# EAGLE board apa102-controller (EAGLE 7.1.0)
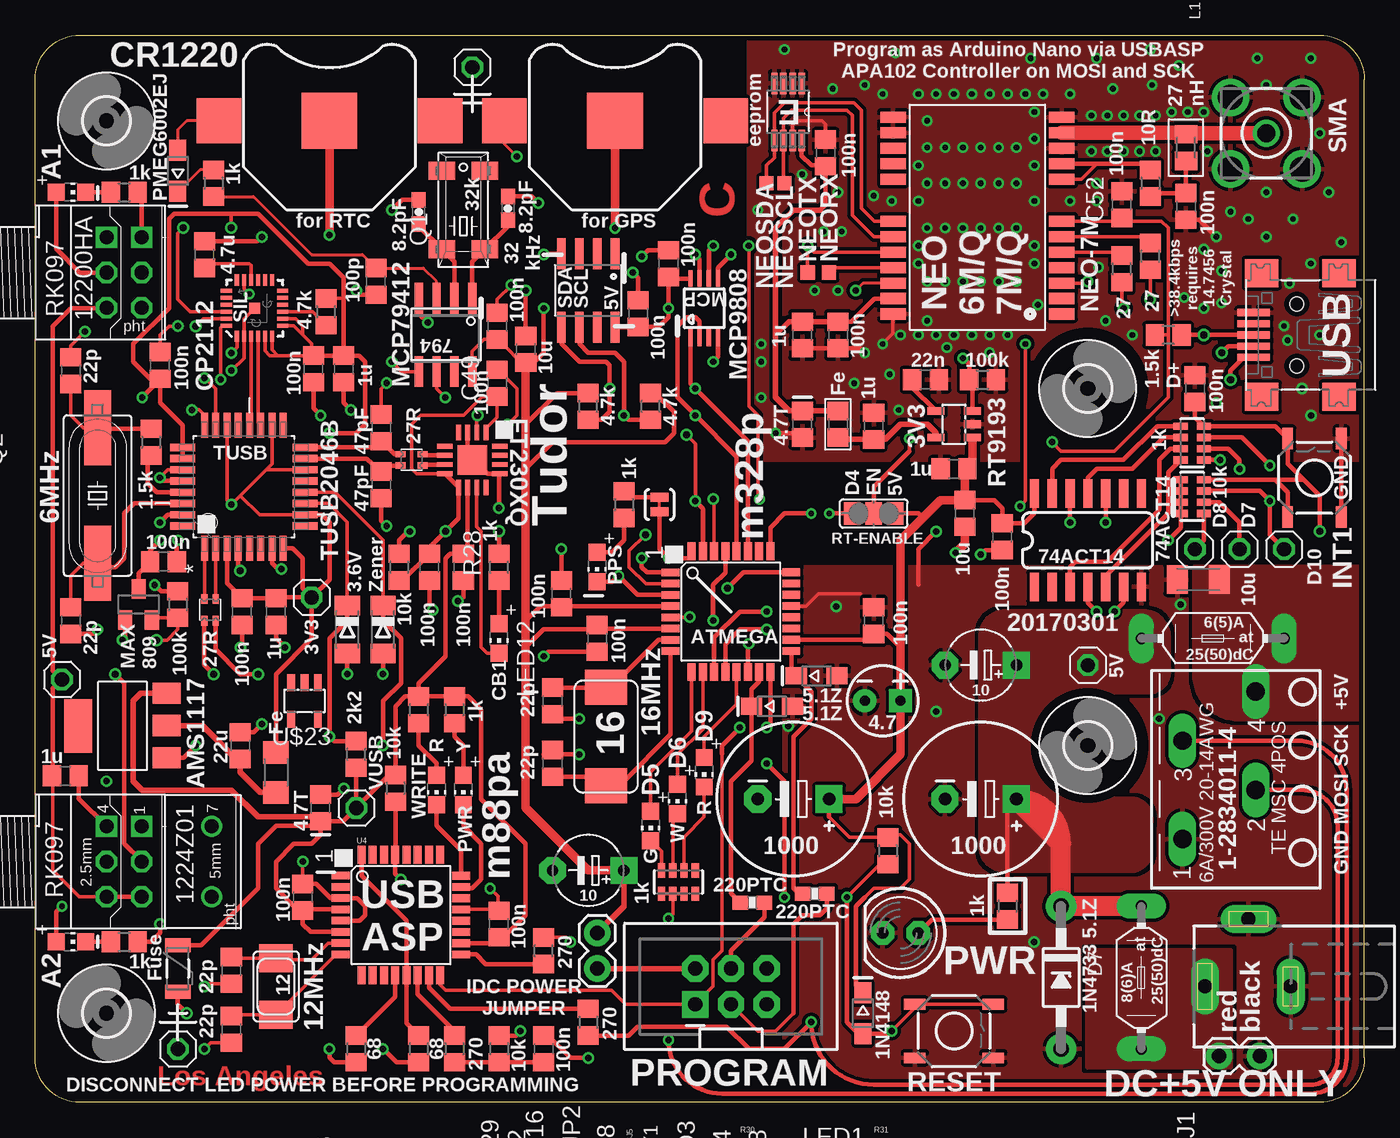
[diagram p2: board, top side]
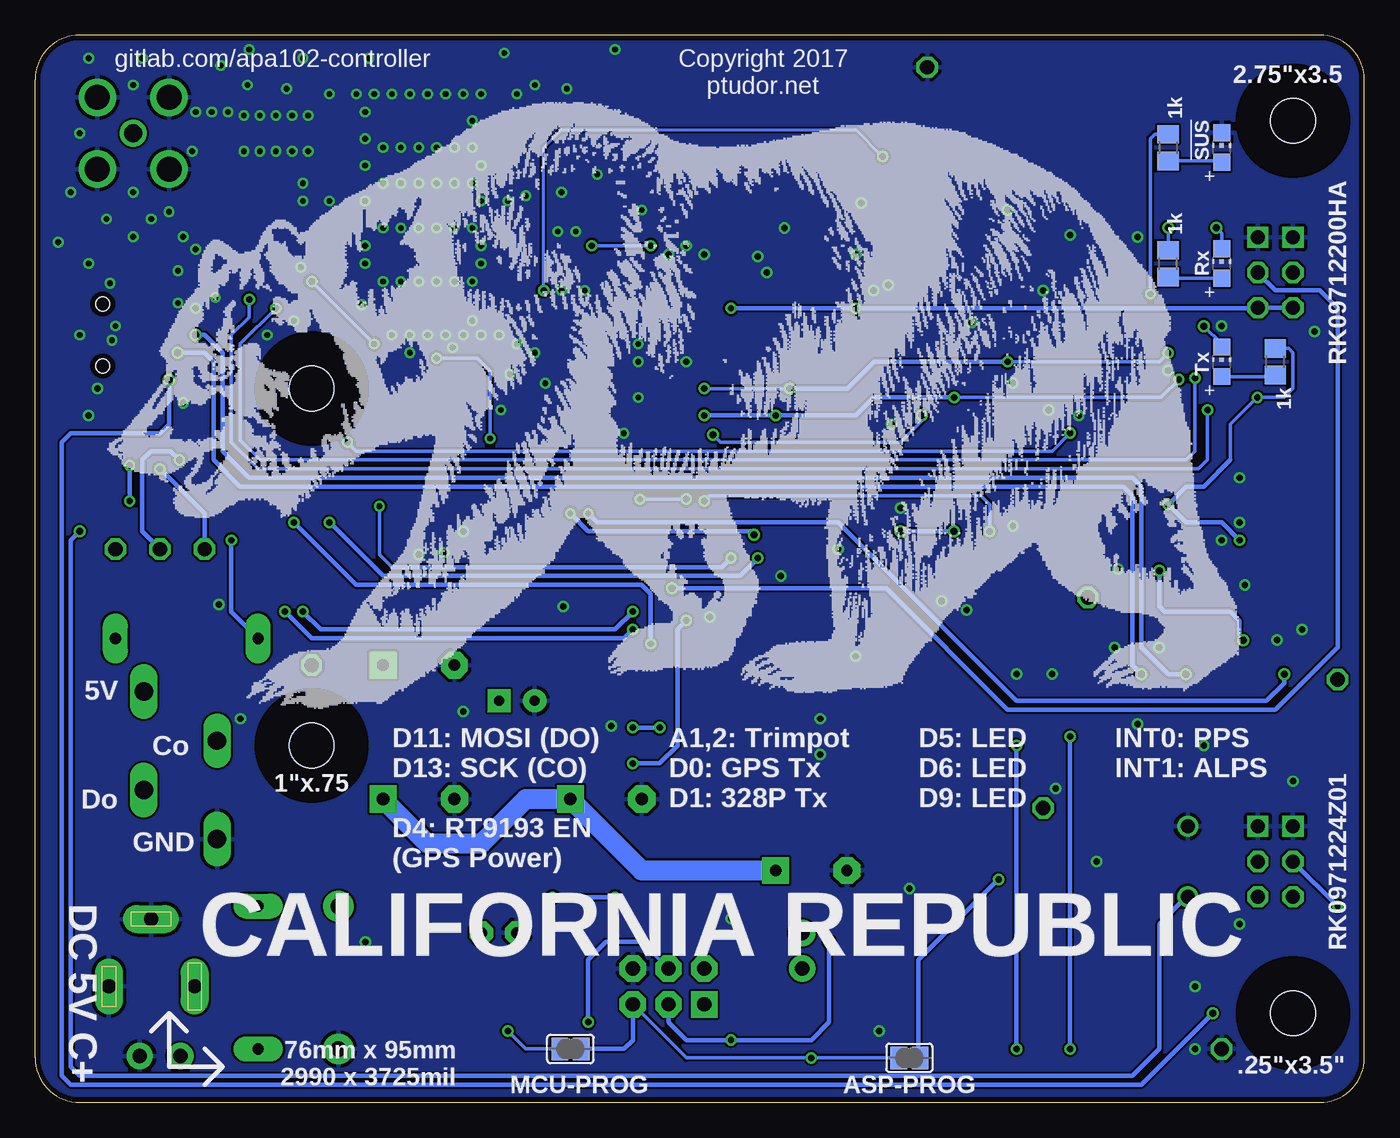
[diagram p3: board, bottom side, seen from below]

Size 94.61 x 75.95 mm. Coordinates in mm from the lower left corner, seen from the top.
Outline: 3.17,75.95 91.44,75.95 arc-90 94.61,72.77 94.61,3.17 arc-90 91.44,0 3.17,0 arc-90 0,3.17 0,72.77 arc-90 3.17,75.95
Copper layers (1*16): Top 0.0356mm / dielectric 1.5011mm / Bottom 0.0356mm
Design rules "LaenPCBOrder *": minimum track width 6mil, minimum drill 13mil, track to track 6mil, track to pad 6mil, pad to pad 6mil, via to via 6mil, smd to smd 6mil, copper to edge 15mil, drill to drill 6mil, minimum pad ring 7mil, minimum via ring 7mil, stop-mask expansion 3mil, vias tented up to drill 25mil, thermal gap 10mil
Net classes: 0 default: width 0.254 mm

## Footprints (pad centres in the part's own frame; a part is rotated, then mirrored left to right if it is on the bottom)
TP10SQ = smd 1 x 1: TP 0,0
BATTCON_12MM = smd 3.962 x 3.962: GND 0,0 | smd 3.175 x 3.175: PWR@1 -7.874,0; PWR@2 7.874,0
C0805 = smd 1.3 x 1.5: 1 -0.95,0; 2 0.95,0
E5-5 = drill 0.813 pad 1.905 square: + -2.54,0 | drill 0.813 pad 1.905 octagon: - 2.54,0
0603-CAP = smd 1.1 x 1: 1 -0.85,0; 2 0.85,0
CPOL-RADIAL-1000UF-25V = drill 0.9 pad 1.93 square: + 2.54,0 | drill 0.9 pad 1.93 octagon: - -2.54,0
CPOL-RADIAL-10UF-25V-KIT = drill 0.7 pad 1.651 square: 1 1.27,0 | drill 0.7 pad 1.651: 2 -1.27,0
C1206K = smd 1.5 x 2: 1 -1.5,0; 2 1.5,0
USB-MINIB = smd 0.5 x 2.308: D+ 0,4.064; D- -0.8,4.064; GND 1.6,4.064; ID 0.8,4.064; VBUS -1.6,4.064 | smd 2 x 2.4: GND1 -4.4,-2; GND2 -4.4,3.5; GND3 4.4,3.5; GND4 4.4,-2 | hole 1: -2.2,1; 2.2,1
MINIMELF@1 = smd 1.4 x 1.8: A 1.7,0; C -1.7,0
SOD323-W@1 = smd 1.5 x 1.2: A 1.45,0; C -1.45,0
DO41Z10 = drill 1.118 pad 2.184: A 5.08,0; C -5.08,0
LITTLEFUSE = drill 0.813 pad 1.778 long: 1 -5.08,0; 2 5.08,0
PTC-1206-WIDE = smd 1 x 1.8: 1 -1.654,0; 2 1.654,0
0805 = smd 1.3 x 1.5: 1 -0.95,0; 2 0.95,0
3,2 = hole 3.2: 0,0
SOT223 = smd 1.499 x 2.007: 1 -2.261,-3.15; 2 0.025,-3.15; 3 2.311,-3.15 | smd 3.81 x 2.007: 4 0,3.15
SOT23B-3 = smd 1 x 1.4: 1 -0.95,-1.1; 2 0.95,-1.1; 3 0,1.1
SOIC-8 = smd 0.6 x 2.2: 1 -1.905,-2.6; 2 -0.635,-2.6; 3 0.635,-2.6; 4 1.905,-2.6; 5 1.905,2.6; 6 0.635,2.6; 7 -0.635,2.6; 8 -1.905,2.6
CHIP-LED0805 = smd 1.2 x 1.2: A 0,-1.05; C 0,1.05
DCJ0202 = drill 1 pad 2 long: 1 0,3.1; 2 4.8,0; 3 0,-3
2X3-SHROUDED = drill 1.016 pad 1.88 square: 1 -1.27,2.54 | drill 1.016 pad 1.88 octagon: 2 1.27,2.54; 3 -1.27,0; 4 1.27,0; 5 -1.27,-2.54; 6 1.27,-2.54
1X02 = drill 1.016 pad 1.88: 1 0,0; 2 2.54,0
1X02_LOCK = drill 1.016 pad 1.88: 1 -0.178,0; 2 2.718,0
M0805 = smd 1.3 x 1.6: 1 -0.95,0; 2 0.95,0
FB1206 = smd 1.6 x 1.803: 1 -1.422,0; 2 1.422,0
LED5MM = drill 0.813 pad 1.676 octagon: A -1.27,0; K 1.27,0
MM20SS = smd 1.27 x 1.88: 1 -2.794,-1.524; 2 2.794,-1.524; 3 2.794,1.524; 4 -2.794,1.524
HC49UP = smd 5.334 x 1.93: 1 -4.826,0; 2 4.826,0
R0805 = smd 1.3 x 1.5: 1 -0.95,0; 2 0.95,0
0603-RES = smd 1.1 x 1: 1 -0.85,0; 2 0.85,0
EXBV4V = smd 0.45 x 0.7: 1 -0.4,-0.775; 2 0.4,-0.775; 3 0.4,0.775; 4 -0.4,0.775
RES4NT = smd 0.508 x 1.016: 1 0,0; 2 0.8,0; 3 1.6,0; 4 2.4,0; 5 2.4,1.651; 6 1.6,1.651; 7 0.8,1.651; 8 0,1.651
TACTILE-SWITCH-SMD = smd 1.524 x 0.762: 1 -2.794,1.905; 2 2.794,1.905; 3 -2.794,-1.905; 4 2.794,-1.905
SJ = smd 1.168 x 1.6: 1 -0.762,0; 2 0.762,0
SJ_2 = smd 1.168 x 1.6: 1 -1.524,0; 2 0,0; 3 1.524,0
SJ_2S-TRACE = smd 0.635 x 1.27: 1 -0.508,0; 2 0.508,0
TQFP32-08 = smd 1.27 x 0.533: 1 -4.293,2.8; 2 -4.293,2; 3 -4.293,1.2; 4 -4.293,0.4; 5 -4.293,-0.4; 6 -4.293,-1.2; 7 -4.293,-2; 8 -4.293,-2.8 | smd 0.559 x 1.27: 9 -2.8,-4.293; 10 -2,-4.293; 11 -1.2,-4.293; 12 -0.4,-4.293; 13 0.4,-4.293; 14 1.2,-4.293; 15 2,-4.293; 16 2.8,-4.293; 25 2.8,4.293; 26 2,4.293; 27 1.2,4.293; 28 0.4,4.293; 29 -0.4,4.293; 30 -1.2,4.293; 31 -2,4.293; 32 -2.8,4.293 | smd 1.27 x 0.559: 17 4.293,-2.8; 18 4.293,-2; 19 4.293,-1.2; 20 4.293,-0.4; 21 4.293,0.4; 22 4.293,1.2; 23 4.293,2; 24 4.293,2.8
SOIC-14 = smd 0.66 x 2.032: 1 -4.445,-3.315; 2 -3.175,-3.315; 3 -1.905,-3.315; 4 -0.635,-3.315; 5 0.635,-3.315; 6 1.905,-3.315; 7 3.175,-3.315; 8 3.175,3.315; 9 1.905,3.315; 10 0.635,3.315; 11 -0.635,3.315; 12 -1.905,3.315; 13 -3.175,3.315; 14 -4.445,3.315
SOP65P490X110-8N = smd 1.524 x 0.457: 1 -2.032,0.965; 2 -2.032,0.33; 3 -2.032,-0.33; 4 -2.032,-0.965; 5 2.032,-0.965; 6 2.032,-0.33; 7 2.032,0.33; 8 2.032,0.965
TEXAS-INSTRUMENTS_BY_ELEMENT14_BATCH_1_QFP80P900X900X145-32N = smd 1.778 x 0.508: 1 -4.369,2.794; 2 -4.369,2.007; 3 -4.369,1.194; 4 -4.369,0.406; 5 -4.369,-0.406; 6 -4.369,-1.194; 7 -4.369,-2.007; 8 -4.369,-2.794; 17 4.369,-2.794; 18 4.369,-2.007; 19 4.369,-1.194; 20 4.369,-0.406; 21 4.369,0.406; 22 4.369,1.194; 23 4.369,2.007; 24 4.369,2.794 | smd 0.508 x 1.778: 9 -2.794,-4.369; 10 -2.007,-4.369; 11 -1.194,-4.369; 12 -0.406,-4.369; 13 0.406,-4.369; 14 1.194,-4.369; 15 2.007,-4.369; 16 2.794,-4.369; 25 2.794,4.369; 26 2.007,4.369; 27 1.194,4.369; 28 0.406,4.369; 29 -0.406,4.369; 30 -1.194,4.369; 31 -2.007,4.369; 32 -2.794,4.369
SOT23-5 = smd 0.55 x 1.2: 1 -0.95,-1.3; 2 0,-1.3; 3 0.95,-1.3; 4 0.95,1.3; 5 -0.95,1.3
UBLOX_NEO-6P = smd 1.8 x 0.8: 1_RESERVED 6.4,-7.4; 2_SS_N 6.4,-6.3; 3_TIMEPULSE 6.4,-5.2; 4_EXTINT0 6.4,-4.1; 5_USB_DM 6.4,-3; 6_USB_DP 6.4,-1.9; 7_VDDUSB 6.4,-0.8; 8_RESERVED 6.4,2.2; 9_VCC_RF 6.4,3.3; 10_GND 6.4,4.4; 11_RF_IN 6.4,5.5; 12_GND 6.4,6.6; 13_GND -5.6,6.6; 14_MOSI/CFG_COM0 -5.6,5.5; 15_MISO/CFG_COM1 -5.6,4.4; 16_CFG_CPS0/SCK -5.6,3.3; 17_RESERVED -5.6,2.2; 18_SDA2 -5.6,-0.8; 19_SCL2 -5.6,-1.9; 20_TXD1 -5.6,-3; 21_RXD1 -5.6,-4.1; 22_V_BCKP -5.6,-5.2; 23_VCC -5.6,-6.3; 24_GND -5.6,-7.4
BUS-SMA = drill 1.27: 1 0,0 | drill 1.778: 2 -2.55,2.55; 3 2.55,2.55; 4 2.55,-2.55; 5 -2.55,-2.55
MSOP08 = smd 0.3 x 1.2: 1 -0.976,-2.113; 2 -0.326,-2.113; 3 0.324,-2.113; 4 0.974,-2.113; 5 0.974,2.112; 6 0.324,2.112; 7 -0.326,2.112; 8 -0.976,2.112
QFN-24 = smd 0.8 x 0.3: 1 -2,1.25; 2 -2,0.75; 3 -2,0.25; 4 -2,-0.25; 5 -2,-0.75; 6 -2,-1.25; 13 2,-1.25; 14 2,-0.75; 15 2,-0.25; 16 2,0.25; 17 2,0.75; 18 2,1.25 | smd 0.3 x 0.8: 7 -1.25,-2; 8 -0.75,-2; 9 -0.25,-2; 10 0.25,-2; 11 0.75,-2; 12 1.25,-2; 19 1.25,2; 20 0.75,2; 21 0.25,2; 22 -0.25,2; 23 -0.75,2; 24 -1.25,2 | smd 0.762 x 0.762: PAD 0,0
TE-MSC-4POS-6A = drill 1.3 long: P$1 -4.5,3.8; P$2 -1,-1.4; P$3 2.5,3.8; P$4 6,-1.4
SO08 = smd 0.61 x 2.21: 1 -1.905,-2.616; 2 -0.635,-2.616; 3 0.635,-2.616; 4 1.905,-2.616; 5 1.905,2.616; 6 0.635,2.616; 7 -0.635,2.616; 8 -1.905,2.616
RK097-DUAL-ELEMENT = drill 1 pad 1.422 square: P$1 -2.5,0; P$4 -2.5,2.5 | drill 1 pad 1.422 octagon: P$2 0,0; P$3 2.5,0; P$5 0,2.5; P$6 2.5,2.5
RK097-DUAL-ELEMENT-W/SWITCH = drill 1 pad 1.422 square: P$1 -2.5,2.5; P$4 -2.5,0 | drill 1 pad 1.422 octagon: P$2 0,2.5; P$3 2.5,2.5; P$5 0,0; P$6 2.5,0 | drill 1 pad 1.422: P$7 -2.5,7.5; P$8 2.5,7.5
QFN4X4-16 = smd 1.1 x 0.35: 1 -1.95,0.975; 2 -1.95,0.325; 3 -1.95,-0.325; 4 -1.95,-0.975; 9 1.95,-0.975; 10 1.95,-0.325; 11 1.95,0.325; 12 1.95,0.975 | smd 0.35 x 1.1: 5 -0.975,-1.95; 6 -0.325,-1.95; 7 0.325,-1.95; 8 0.975,-1.95; 13 0.975,1.95; 14 0.325,1.95; 15 -0.325,1.95; 16 -0.975,1.95 | smd 2.1 x 2.1: C 0,0
SOT23-5L = smd 0.55 x 1.2: 1 -0.95,-1.3; 2 0,-1.3; 3 0.95,-1.3; 4 0.95,1.3; 5 -0.95,1.3
WPAD-1-PTH-2.54 = drill 1.016 octagon: 1 0,0
NX5032 = smd 2 x 2.4: P$1 2,0; P$2 -2,0
CRYSTAL-ABRACON-ABM2 = smd 2.5 x 3: P$1 -3.5,0; P$2 3.5,0

## Placement (x,y rotation side)
18  TPTP10SQ  [TP10SQ]  52.07,65.41 90 top
19  TPTP10SQ  [TP10SQ]  53.34,65.41 90 top
BAT1  [BATTCON_12MM]  41.27,69.85 0 top
BAT2  [BATTCON_12MM]  20.95,69.85 0 top
C1  1u  [C0805]  54.61,48.26 270 top
C2  100n  [C0805]  57.15,54.61 270 top
C3  100pf  [C0805]  24.26,58.42 270 top
C4  [E5-5]  67.31,31.11 180 top
C5  100  [C0805]  37.47,36.2 90 top
C6  [E5-5]  39.37,16.51 180 top
C7  [C0805]  36.83,28.57 270 top
C8  [C0805]  36.83,24.13 90 top
C9  10 uF  [C0805]  66.17,41.91 270 top
C10  4.7uF  [C0805]  12.06,60.33 90 top
C11  [C0805]  59.69,34.29 90 top
C12  [C0805]  68.83,40.26 270 top
C13  10  [C0805]  34.92,53.59 90 top
C14  8.2pF  [0603-CAP]  33.66,63.63 90 top
C15  8.2pF  [0603-CAP]  27.3,63.37 90 top
C16  100  [C0805]  40.01,33.02 270 top
C17  [C0805]  32.89,55.24 90 top
C18  100  [C0805]  54.61,54.61 270 top
C19  22pF  [C0805]  13.97,5.21 270 top
C20  1uF  [C0805]  59.69,48.13 90 top
C21  CAP-09538  [CPOL-RADIAL-1000UF-25V]  67.31,21.59 0 top
C22  CAP-09538  [CPOL-RADIAL-1000UF-25V]  53.98,21.59 0 top
C23  100nF  [C0805]  81.92,63.75 270 top
C24  0.1  [C0805]  56.26,67.56 90 top
C25  100nF  [C0805]  45.09,59.69 90 top
C26  [CPOL-RADIAL-10UF-25V-KIT]  60.33,28.57 0 top
C27  22pF  [C0805]  13.97,9.4 270 top
C28  100  [C0805]  19.05,14.61 90 top
C29  100nF  [C0805]  33.02,12.7 90 top
C30  4.7 tant  [C0805]  20.32,20.95 90 top
C31  1uF  [C0805]  21.97,52.2 270 top
C32  100nF  [C0805]  19.81,52.2 270 top
C33  47pF  [C0805]  24.64,43.94 270 top
C34  47pF  [C0805]  24.64,48.01 90 top
C35  22uF  [C0805]  14.61,25.4 90 top
C36  22pF  [C0805]  2.54,34.29 270 top
C37  22pF  [C0805]  2.54,52.07 90 top
C38  100nF  [C0805]  17.14,34.92 270 top
C39  100nF  [C0805]  14.73,34.92 270 top
C40  1uF  [C0805]  8.89,52.45 90 top
C41  1uF  [C0805]  65.41,45.09 180 top
C42  22nF low noise  [C0805]  63.37,51.44 0 top
C43  100nF  [C0805]  30.48,38.1 270 top
C44  100nF  [C0805]  28.07,38.1 270 top
C45  [C1206K]  82.8,37.21 180 top
C46  100nF  [C0805]  42.93,56.13 90 top
C47  10 uF  [C0805]  82.55,50.8 90 top
C48  100nF  [C0805]  9.14,38.48 0 top
C49  100n  [C0805]  32.89,51.18 90 top
C50  100nF  [C0805]  2.16,23.24 0 top
C51  100nF  [C0805]  36.2,3.81 90 top
C52  100nF  [C0805]  77.34,63.88 90 top
CN1  [USB-MINIB]  90.81,54.61 90 top
D1  [MINIMELF@1]  24.77,33.66 270 top
D2  [MINIMELF@1]  22.23,33.66 270 top
D3  Schottky  [SOD323-W@1]  10.16,66.29 90 top
D4  5.1Z  [SOD323-W@1]  52.45,28.19 0 top
D5  5.1Z  [SOD323-W@1]  55.63,30.35 0 top
D6  1n4148-ish  [SOD323-W@1]  58.93,6.35 270 top
D7  [DO41Z10]  73.03,8.89 270 top
F1  [LITTLEFUSE]  78.74,8.89 90 top
F2  [LITTLEFUSE]  83.82,33.02 0 top
F3  PTCSMD-W  [PTC-1206-WIDE]  10.16,9.53 270 top
FB1  [0805]  57.15,48.26 90 top
H1  MOUNT-HOLE3.2  [3,2]  5.08,6.35 90 top
H2  MOUNT-HOLE3.2  [3,2]  74.93,25.4 0 top
H3  MOUNT-HOLE3.2  [3,2]  74.93,50.8 0 top
H4  MOUNT-HOLE3.2  [3,2]  5.08,69.85 90 top
IC1  REG1117  [SOT223]  6.22,26.8 90 top
IC2  [SOT23B-3]  7.37,35.43 0 top
IC3  IC_MCP7940M-SOIC8  [SOIC-8]  29.21,54.61 180 top
ISUSPEND  A1-WRITE  [CHIP-LED0805]  10.16,67.94 0 bottom
J1  DCJ0202  [DCJ0202]  86.36,8.26 90 top
JP1  [2X3-SHROUDED]  49.53,8.26 90 top
JP2  M02PTH  [1X02]  40.01,9.53 90 top
JP3  M02LOCK  [1X02_LOCK]  84.45,3.3 0 top
L1  27nH  [M0805]  81.92,67.94 270 top
L2  [FB1206]  17.14,23.5 90 top
LED1  PWR-5MM  [LED5MM]  61.59,12.06 180 top
LED2  A0-POWER  [CHIP-LED0805]  30.48,22.23 180 top
LED3  D5  [CHIP-LED0805]  43.81,19.68 180 top
LED4  D6  [CHIP-LED0805]  45.72,21.59 180 top
LED5  A1-WRITE  [CHIP-LED0805]  28.57,22.23 180 top
LED6  G0-TX  [CHIP-LED0805]  10.16,52.7 0 bottom
LED7  G1-RX  [CHIP-LED0805]  10.16,59.69 0 bottom
LED8  D9  [CHIP-LED0805]  47.62,23.5 180 top
LED9  PPS  [CHIP-LED0805]  40.01,38.1 180 top
LED10  [CHIP-LED0805]  2.54,11.43 270 top
LED11  [CHIP-LED0805]  2.54,64.77 270 top
LED12  CBUS1  [CHIP-LED0805]  33.02,33.02 180 top
Q1  [MM20SS]  30.48,63.5 90 top
Q2  [HC49UP]  4.45,43.18 270 top
R1  1k  [R0805]  12.7,65.41 270 top
R2  27-68  [R0805]  79.38,60.2 90 top
R3  [R0805]  43.81,49.53 90 top
R4  [R0805]  39.37,49.53 90 top
R5  27-68  [R0805]  77.34,59.31 90 top
R6  10k  [R0805]  25.65,22.35 270 top
R7  [R0805]  69.22,13.97 270 top
R8  270  [R0805]  29.84,3.81 270 top
R9  10k  [R0805]  60.71,17.91 270 top
R10  [R0805]  6.35,11.43 0 top
R11  10k  [R0805]  25.91,38.1 270 top
R12  10  [R0805]  79.38,65.41 270 top
R13  100k  [R0805]  10.16,35.43 270 top
R14  270  [R0805]  39.37,5.71 270 top
R15  1.5k  [R0805]  8.26,46.99 270 top
R16  270  [R0805]  36.2,10.79 90 top
R17  2k2  [R0805]  22.86,24.77 90 top
R18  68  [R0805]  22.86,3.81 270 top
R19  68  [R0805]  27.3,3.81 270 top
R20  1k  [R0805]  29.84,27.94 270 top
R21  1k  [R0805]  27.3,27.94 270 top
R22  1k  [R0805]  6.35,52.7 90 bottom
R23  1k  [R0805]  13.97,59.69 90 bottom
R24  4.7k  [R0805]  20.7,56.26 270 top
R25  [R0805]  6.35,64.77 0 top
R26  [R0805]  41.91,42.55 270 top
R27  1.5k  [R0805]  80.64,54.61 180 top
R28  1k  [R0805]  33.02,38.1 90 top
R29  1k  [R0805]  13.97,67.94 270 bottom
R30  220PTC  [0603-RES]  51.05,14.22 0 top
R31  220PTC  [0603-RES]  55.5,14.86 0 top
R32  1k  [R0805]  33.02,3.81 270 top
R33  100k  [R0805]  67.44,51.44 0 top
RN1  [EXBV4V]  12.45,35.05 0 top
RN2  [EXBV4V]  26.8,45.72 270 top
RP1  1k  [RES4NT]  46.99,16.51 180 top
RP2  10k  [RES4NT]  83.19,41.91 90 top
RP3  1k  [RES4NT]  83.19,45.72 90 top
S1  [TACTILE-SWITCH-SMD]  65.41,5.08 0 top
S2  [TACTILE-SWITCH-SMD]  91.06,44.45 90 top
SJ2  [SJ]  56.52,3.81 0 bottom
SJ3  [SJ]  32.38,3.17 180 bottom
SJ4  [SJ_2]  59.69,41.91 0 top
SJ5  SOLDERJUMPERTRACE  [SJ_2S-TRACE]  44.45,42.55 90 top
TP1  TPTP10SQ  [TP10SQ]  54.99,59.05 90 top
TP2  TPTP10SQ  [TP10SQ]  56.52,59.05 90 top
U1  ATMEGA328P  [TQFP32-08]  49.53,34.92 0 top
U2  74HC04_HEX_INVERTERSOIC  [SOIC-14]  75.56,40.01 0 top
U3  24AA32A-I/MS  [SOP65P490X110-8N]  53.59,70.48 270 top
U4  ATMEGA328P  [TQFP32-08]  26.04,13.34 0 top
U5  TEXAS-INSTRUMENTS_BY_ELEMENT14_BATCH_1_TUSB2046BVF  [TEXAS-INSTRUMENTS_BY_ELEMENT14_BATCH_1_QFP80P900X900X145-32N]  14.86,43.81 90 top
U6  [SOT23-5]  65.41,48.26 90 top
U$1  [BEARMED200DPI]  90.17,25.4 0 bottom
U$2  UBLOX_NEO-6  [UBLOX_NEO-6P]  66.67,63.5 0 top
U$3  BUS-SMA  [BUS-SMA]  87.63,68.96 180 top
U$7  MCP98  [MSOP08]  47.62,56.52 0 top
U$11  CP2112  [QFN-24]  15.62,56.52 90 top
U$17  TE-MSC-4POS-6A  [TE-MSC-4POS-6A]  85.47,23.24 90 top
U$18  ATSHA204A  [SO08]  39.37,57.78 180 top
U$19  RK097-DUAL-ELEMENT  [RK097-DUAL-ELEMENT]  5.08,59.05 270 top
U$20  RK097-SINGLE-W/SWITCH-ROTARY  [RK097-DUAL-ELEMENT-W/SWITCH]  5.08,17.14 270 top
U$21  FT230XQ  [QFN4X4-16]  31.11,45.72 270 top
U$23  ESDTUDOR  [SOT23-5L]  19.18,28.57 180 top
WP1  [WPAD-1-PTH-2.54]  82.55,39.37 0 top
WP2  [WPAD-1-PTH-2.54]  85.72,39.37 0 top
WP3  [WPAD-1-PTH-2.54]  31.11,73.66 0 top
WP4  [WPAD-1-PTH-2.54]  10.16,3.81 0 top
WP5  [WPAD-1-PTH-2.54]  88.9,39.37 0 top
WP6  [WPAD-1-PTH-2.54]  74.93,31.11 0 top
WP7  [WPAD-1-PTH-2.54]  22.86,20.95 0 top
WP8  [WPAD-1-PTH-2.54]  19.68,35.94 0 top
WP9  [WPAD-1-PTH-2.54]  1.91,30.1 0 top
X1  [NX5032]  17.14,8.26 270 top
Y1  [CRYSTAL-ABRACON-ABM2]  40.64,26.04 90 top

## Tracks (layer width: path | path; a pad name or v marks a point on that pad's centre or on a via)
5V_TEMSC
  pour Top (isolate 0.254, rank 2, no thermals): 82.55,38.1 82.55,30.48 arc90 85.72,27.3 94.61,27.3 94.61,38.1
88_A0
  Top 0.305: LED2.C 30.48,19.68 31.75,18.41 31.75,15.88 31.11,15.24 30.42,15.24 U4.23
88_A1
  Top 0.305: U4.24 30.33,17.93 28.57,19.68 LED5.C
328_SS  (via drill 0.46)
  Top 0.305: U2.10 v76.2,41.27 | U1.14 50.73,32.57 v50.8,32.64
  Bottom 0.305: v76.2,41.27 71.75,36.83 51.44,36.83 50.8,36.2 v50.8,32.64
+3V3
  Top 0.305: U$2.23_VCC 59.74,57.2 58.1,55.56 C2.1 | U3.8 54.56,67.36 55.24,66.67 56.2,66.67 C24.1 56.26,63.88 55.88,63.5
  Top 0.406: 52.7,54.61 52.7,62.23 53.98,63.5 55.88,63.5 | 52.7,54.61 52.7,50.16 53.66,49.21 C1.1 FB1.2 | 52.7,54.61 53.66,55.56 C18.1 C2.1
+5V  (via drill 0.46)
  Top 0.254: 37.55,35.33 C5.1 | 40.25,33.73 C16.1 | 61.59,32.38 61.59,33.66 | U$20.P$6 3.13,14.64 1.27,16.51 1.27,23.18 C50.1 | 5.04,56.52 U$19.P$3 | IC3.8 31.11,53.47 31.94,54.3 C17.1 33.34,53.85 33.4,53.85 34.6,52.64 C13.1 | 59.05,14.61 59.69,15.24 61.59,15.24 62.23,15.88 62.23,18.41 61.59,19.05 60.9,19.05 R9.1 57.98,18.86 56.52,20.32 | 68.89,15.24 R7.1
  Top 0.305: U1.4 37.55,35.33 35.96,35.33 34.92,34.29 | U1.6 40.25,33.73 | 61.59,32.38 60.64,33.34 C11.1 59.27,32.92 U1.18 | 34.92,29.84 34.92,32.38 36.2,33.66 39.69,33.66 C16.1 | R7.1 69.22,20.95 C21.+ | R4.2 37.15,50.48 34.92,48.26 | R3.2 44.13,50.48 45.47,49.15 45.47,47.62 44.83,46.99 36.83,46.99 34.92,45.09 | v36.2,56.52 36.2,53.34 35.56,52.7 34.99,52.7 C13.1 | U$7.8 45.2,58.63 C25.1 v45.09,56.52 45.09,55.88 44.39,55.18 C46.1 42.91,55.17 U$18.8 | v80.64,40.01 81.53,40.89 RP2.8 RP2.7 RP2.6 RP2.5 | U$20.P$6 U$20.P$3 | U2.14 71.12,41.91 70.42,41.21 C12.1 68.83,42.29 68.27,42.86 C9.1 | SJ4.3 62.87,41.91 63.18,41.59 | 1.27,23.18 1.27,29.46 WP9.1 1.27,30.73 1.27,55.24 2.54,56.52 5.04,56.52 | 59.05,14.61 58.42,13.97 58.42,8.31 D6.C | 56.52,20.32 C22.+
  Top 0.406: JP2.2 41.91,13.97 C6.+
  Top 0.61: C13.1 34.92,48.26 34.92,45.09 34.92,34.29 34.92,29.84 34.92,20.95 39.37,16.51 C6.+ | C22.+ 58.42,21.59 61.59,24.77 C26.1 61.59,32.38 61.59,40.01 63.18,41.59 64.45,42.86 C9.1 66.17,44.9 C41.1 66.7,45.44 U6.1
  Top 1.422: 72.9,18.54 C21.+ arc-90 73.03,18.41 D7.C F1.2
  Bottom 0.305: v45.09,56.52 v36.2,56.52 7.62,56.52 U$19.P$6 U$19.P$3 | v80.64,40.01 80.64,34.92 F2.1
  Bottom 1.422: C6.+ 51.44,16.51 C22.+ 59.69,21.59 62.87,18.41 66.67,18.41 C21.+
  pour Top (rank 3, no thermals): 69.11,34.92 78.85,34.92 arc-90 80.64,33.13 80.64,30.63 arc-90 79.23,29.21 74.93,29.21 74.93,21.59 78.21,21.59 arc-90 79.38,19.79 79.38,17.93 arc-90 77.96,16.51 69.11,16.51 arc-90 67.31,18.31 67.31,33.13 arc-90
ADC1_TRIMPOT  (via drill 0.5)
  Top 0.305: U1.24 50.42,37.73 v49.28,36.58
  Bottom 0.305: v49.28,36.58 34.04,36.58 25.4,27.94 6.35,27.94 1.91,32.38 1.91,56.52 3.17,57.78 6.35,57.78 7.58,59.02 U$19.P$5
ADC2_TRIMPOT  (via drill 0.41, 0.5)
  Top 0.305: U$20.P$2 7.58,17.18 6.35,18.41 6.35,29.84 v5.71,30.48 | U1.25 52.33,40.9 53.34,41.91 v55.24,41.91
  Bottom 0.305: v55.24,41.91 54.61,41.27 37.47,41.27 24.77,28.57 6.99,28.57 5.71,29.84 v5.71,30.48
ARD_D4_GPS_EN  (via drill 0.41, 0.5)
  Top 0.254: U1.2 43.47,36.92 42.29,38.1 42.29,39.24 v43.43,40.39 | 62.23,46.35 v62.23,47.24
  Top 0.305: v56.52,41.91 SJ4.1 SJ4.2 59.69,43.81 62.23,46.35 | v66.04,52.96 66.49,52.51 R33.1 66.7,51.09 U6.3
  Bottom 0.254: v62.23,47.24 62.23,52.07 63.12,52.96 v66.04,52.96
  Bottom 0.305: v43.43,40.39 43.69,40.64 55.24,40.64 v56.52,41.91
ARD_D7  (via drill 0.46)
  Top 0.305: U2.4 74.93,35.56 v75.56,34.92 | v52.07,34.92 50.16,34.92 48.33,33.09 U1.11
  Bottom 0.305: v75.56,34.92 74.3,33.66 53.34,33.66 v52.07,34.92
ARD_D8  (via drill 0.46)
  Top 0.305: U2.6 77.47,35.56 v76.83,34.92 | v52.07,33.66 50.16,33.66 49.13,32.62 U1.12
  Bottom 0.305: v76.83,34.92 74.93,33.02 52.7,33.02 v52.07,33.66
ARD_MOSI  (via drill 0.46)
  Top 0.305: R14.2 42.23,4.76 42.87,5.4 49.21,5.4 50.8,3.81 53.34,3.81 v55.24,5.71 arc90 59.69,1.27 90.81,1.27 arc90 92.71,3.17 92.71,19.68 arc90 90.16,22.24 U$17.P$2 | R30.2 51.9,13.17 49.53,10.79 JP1.4
  Bottom 0.254: JP1.4 51.44,11.43
  Bottom 0.305: 51.44,11.43 53.98,11.43 55.24,10.16 v55.24,5.71
ARD_SCK  (via drill 0.46)
  Top 0.254: 53.98,6.35 52.7,5.08 51.44,5.08 JP1.3 | R16.2 37.78,11.74 v38.1,11.43
  Top 0.305: U$17.P$3 89.83,25.74 arc-90 93.34,22.23 93.34,3.17 arc-90 90.81,0.64 48.9,0.64 arc-90 v45.09,4.45 | R31.2 56.35,13.8 55.88,13.34 54.61,13.34 53.98,12.7 53.98,6.35
  Bottom 0.254: 46.99,4.45 v45.09,4.45
  Bottom 0.305: JP1.3 49.53,5.71 48.26,4.45 v45.09,4.45 39.37,4.45 38.1,5.71 v38.1,11.43
D5_LED_GREEN
  Top 0.254: LED3.A 43.81,23.5 46.73,26.41 U1.9
D6_LED_WHITE
  Top 0.254: U1.10 47.53,26.57 45.72,24.77 LED4.A
D9_LED_RED
  Top 0.254: LED8.A 47.62,26.04 49.93,28.34 U1.13
D10-POSTRES  (via drill 0.46)
  Top 0.305: RP2.3 87.17,43.51 v87.88,42.8 87.88,40.39 WP5.1 | RP3.3 85.9,47.32 v87.88,45.34
  Bottom 0.305: v87.88,45.34 v87.88,42.8
DCJACK_TO_PTC
  pour Top (isolate 0.254, no thermals): 85.09,10.79 85.09,2.54 74.93,2.54 74.93,10.79
FT230_VCCIO  (via drill 0.5)
  Top 0.254: U$21.8 27.14,44.74 26.8,45.09 26.8,48.26 27.43,48.9 30.48,48.9 31.82,50.23 C49.1 32.89,48.77 32.09,47.97
  Top 0.305: R11.2 26.17,37.15 C44.1 28.07,39.5 v29.21,40.64 30.14,41.57 U$21.9 U$21.8 | v33.02,40.64 R28.2 | U$21.1 32.09,47.97
  Bottom 0.305: v29.21,40.64 v33.02,40.64
FT_CB0
  Top 0.254: U$21.11 31.44,40.95 31.75,40.64 31.75,32.38 32.16,31.97 LED12.C
GND  (via drill 0.41, 0.46)
  Top 0.254: U1.5 46.59,34.52 v46.61,34.54 | C8.2 36.2,24.77 | v32.38,15.24 32.94,14.69 32.94,13.73 | U$2.24_GND 61.08,54.73 v60.33,53.98 | U1.21 54.88,35.33 55.75,36.2 58.73,36.2 | C28.2 v19.05,17.14 | U4.21 32.94,13.73 | 32.94,13.73 C29.2 | RP1.6 45.39,13.39 v45.09,13.08 | RP1.7 RP1.6 | RP1.5 RP1.6 | v13.97,52.07 14.87,52.97 U$11.2 14.87,55.77 U$11.PAD | C27.2 12.26,8.45 v12.06,8.26 | C19.2 12.51,4.26 v12.06,3.81 | C40.2 8.89,54.61 9.53,55.24 v10.16,55.24 | C37.2 2.54,53.85 v3.56,54.86 | C34.2 24.64,50.8 v25.02,51.18 | C17.2 32.89,57.15 v33.91,58.17 | C49.2 32.96,52.13 34.29,50.8 34.29,48.9 v33.66,48.26 | U5.27 9.45,45.01 v8.89,44.45 | U3.7 53.92,69.55 54.23,69.85 56.01,69.85 56.26,69.6 C24.2
  Top 0.305: U1.3 42.87,36.12 v41.53,37.47 41.11,37.05 LED9.C | 76.16,67.9 v76.33,67.69 | 76.08,70.1 v76.33,70.23 | C16.2 36.52,32.07 v36.2,31.75 | C13.2 v34.92,57.78 | 60.44,71.64 v60.33,71.75 | C18.2 C2.2 58.73,53.66 v59.05,53.34 | v52.7,47.62 54.3,47.62 C1.2 | U4.5 23.09,12.94 23.5,13.34 23.5,13.97 22.93,14.54 U4.3 21.02,14.54 20,15.55 C28.2 | C5.2 v37.47,39.37 | U$7.7 47.3,60.02 v46.99,60.33 | U$7.6 47.95,60.65 v48.26,60.96 | U$7.5 48.6,59.39 v49.53,60.33 | U$7.4 48.6,53.04 v48.26,52.7 | C23.2 82.86,62.8 v84.07,61.59 | S2.4 S2.3 | D2.A v22.23,30.48 | D1.A v24.77,30.48 | C33.2 24.64,41.4 v25.02,41.02 | v38.73,27.3 37.15,27.3 C7.2 | C36.2 4.13,33.34 v4.45,33.66 | U5.28 9.12,44.22 v8.89,44.45 | C14.2 35.34,64.48 v35.81,64.01 | C15.2 26.12,64.22 v25.4,63.5 | IC3.4 27.3,56.13 v27.94,55.5 | C39.2 14.73,32.51 v14.61,32.38 | C38.2 17.14,33.02 v17.78,32.38 | C32.2 19.81,49.4 v20.32,48.9 | C31.2 21.97,49.78 v22.48,49.28 | C10.2 15.81,61.27 v16.13,61.59 | 36.2,24.77 v38.73,24.77 | U5.31 9.42,41.81 v8.89,41.27 | 62.87,36.83 62.87,39.37 v64.14,40.64 | C3.2 23.18,57.47 v22.86,57.78 | C25.2 43.62,60.64 v43.18,60.2 | C43.2 30.48,35.94 v30.1,35.69 | C44.2 28.07,35.31 v28.32,35.05 | U$18.4 36.27,60.4 v36.2,60.33 | C46.2 42.93,58.67 v42.55,59.05 | R13.1 8.96,36.38 v8.51,36.83 | IC2.1 6.42,33.09 v6.22,32.89 | C48.2 10.09,39.94 v10.16,40.01 | 9.37,23.98 IC1.1 10.57,24.54 v11.43,25.4 | C12.2 67.63,39.31 v67.31,38.99 | C35.2 15.55,26.35 v16.13,26.92 | U5.7 16.87,38.38 17.27,37.97 v17.53,37.97 | U$19.P$4 7.58,64.49 R25.2 | R10.2 8.26,11.43 8.89,12.06 v8.89,12.7 | C30.2 21.53,21.91 v21.97,22.35 | C50.2 3.11,21.62 U$20.P$4 | R32.1 34.22,4.76 v34.54,5.08 | U$21.13 33.02,44.74
  Top 0.305: 33.02,44.74 v33.02,42.29 | U$21.3 30.79,46.05 U$21.C 31.88,44.96 32,44.96 32.22,44.74 33.02,44.74
  Top 0.61: BAT2.GND v20.95,61.72 | BAT1.GND v41.27,62.23 | C9.2 66.17,39.75 v65.53,39.12
  other vias: 71.12,11.43 80.01,27.3 78.61,67.69 79.76,70.23 79.76,67.69 77.47,67.69 71.37,56.77 76.71,72.14 82.04,70.48 79.5,72.39 57.02,35.31 80.9,70.48 78.61,70.23 55.5,57.78 77.47,70.23 81.53,35.43 54.61,66.04 83.19,60.71 61.21,74.68 60.83,51.82 84.07,49.78 83.19,70.48 83.44,67.69 56.13,61.98 56.77,72.14 62.87,71.75 64.14,71.75 65.41,71.75 66.67,71.75 67.94,71.75 69.22,71.75 70.48,71.75 71.75,71.75 64.77,65.41 66.04,67.94 67.31,67.94 69.85,67.94 75.56,65.41 73.66,64.14 75.56,64.14 69.85,58.42 61.59,54.61 87,74.3 64.77,58.42 60.96,64.14 90.81,74.3 87.63,61.59 90.81,59.69 67.94,53.34 78.11,54.61 87.63,64.77 92.08,64.77 89.53,62.87 85.09,63.37 86.36,62.87 91.44,68.96 87.63,72.39 53.34,74.93 59.05,72.39 70.87,74.3 75.56,74.3 51.44,63.5 57.15,57.78 57.4,61.98 64.9,53.72 89.28,58.29 75.69,59.44 76.2,55.63 75.18,70.23 75.18,67.69 59.69,64.52 89.15,54.23 51.69,53.98 63.5,67.94 63.5,65.41 63.5,62.23 63.5,58.42 62.87,54.61 64.14,54.61 65.41,54.61 66.67,54.61 66.04,58.42 67.31,58.42 64.77,62.23 66.04,62.23 67.31,62.23 68.58,62.23 69.85,62.23 66.04,65.41 67.31,65.41 68.58,65.41 69.85,65.41 62.87,59.69 71.12,66.67 68.58,67.94 71.12,64.14 64.77,67.94 68.58,58.42 71.12,60.96 81.79,57.28 62.87,66.67 62.87,60.96 71.12,68.58 62.87,64.14 71.12,59.69 63.5,69.85 71.12,70.48 63.5,55.63 69.22,54.61 67.94,54.61 64.14,27.81 84.45,59.18 88.9,55.24 92.96,61.21 91.44,54.61 84.45,56.9 90.17,50.8 90.81,48.9 58.29,51.18 61.47,49.28 51.69,50.16 51.69,52.7 57.15,64.77 79.38,74.93 73.66,71.75 81.41,73.79 83.19,56.52 5.08,22.86 53.59,26.8
  pour Bottom: -1.91,-1.27 95.89,-1.27 96.52,79.38 -1.91,78.74
  pour Top (isolate 0.254): 50.8,45.72 95.25,45.72 95.25,76.83 50.8,76.83
  pour Top (isolate 0.254, rank 5): 53.34,38.1 53.34,-1.91 95.89,-1.91 95.89,38.1
GPS_RXD
  Top 0.254: U$2.21_RXD1 56.86,59.4 TP2.TP
GPS_SCL
  Top 0.254: 19.TP 53.26,65.48 U3.6 53.26,70.03 53.85,70.61 57.78,70.61 58.17,70.23 58.17,63.12 59.69,61.59 U$2.19_SCL2
  Top 0.406: U$2.19_SCL2
GPS_SDA
  Top 0.254: U$2.18_SDA2 59.73,62.7 58.8,63.63 58.8,70.61 58.29,71.12 53.34,71.12 52.63,70.41 U3.5 52.63,67.23 52.07,66.67 18.TP
GPS_TXD  (via drill 0.41, 0.46)
  Top 0.254: U$2.20_TXD1 55.45,60.5 v54.99,60.96 TP1.TP | v50.8,60.96 50.8,49.53 51.44,48.9 51.44,43.05 v51.56,42.93 | U1.30 48.33,42.86 v48.26,42.93
  Bottom 0.254: v54.99,60.96 v50.8,60.96 | v48.26,42.93 v51.56,42.93
HEX3
  Top 0.305: U2.3 73.66,38.1 74.04,38.48 76.33,38.48 80.01,42.16 80.01,45.72 80.81,46.52 RP3.7
HEX5
  Top 0.305: U2.5 76.2,37.47 80.64,41.91 80.64,44.83 RP3.8
HEX11
  Top 0.305: U2.11 74.93,44.45 75.56,45.09 78.11,45.09 80.34,47.32 RP3.6
HEX13
  Top 0.305: RP3.5 79.87,48.12 77.47,45.72 73.03,45.72 72.39,45.09 U2.13
I2CSCL  (via drill 0.46)
  Top 0.254: U$11.24 13.36,55.27 13.21,55.12 v13.21,51.44 | IC3.6 28.57,50.8 v29.21,50.16
  Top 0.305: U1.28 49.93,45.95 v46.99,48.9 45.72,50.16 45.72,55.24 46.35,55.88 46.99,55.88 47.3,55.57 U$7.2 | R3.1 42.23,48.58 v41.91,48.9 41.91,52.7 41.27,53.34 39.37,53.34 38.73,53.98 U$18.6
  Bottom 0.254: v29.21,50.16 14.48,50.16 v13.21,51.44
  Bottom 0.305: v46.99,48.9 v41.91,48.9 36.2,48.9 34.92,50.16 v29.21,50.16
INT0  (via drill 0.41, 0.46)
  Top 0.254: U$2.3_TIMEPULSE 74.81,58.3 v74.93,58.42 | v70.48,53.98 70.48,42.8 v70.1,42.42
  Top 0.305: U1.32 46.74,38.73 v45.09,38.73 44.45,39.37 SJ5.1
  Bottom 0.254: v70.48,53.98 v74.93,58.42 | v70.1,42.42 70.1,38.99 69.22,38.1
  Bottom 0.305: 69.22,38.1 45.72,38.1 v45.09,38.73
INT1  (via drill 0.46)
  Top 0.305: U1.1 43.55,37.73 43.18,38.1 v43.18,38.73 | U2.12 v73.66,41.27
  Bottom 0.305: v73.66,41.27 69.85,37.47 44.45,37.47 v43.18,38.73
INT1_POSTRES  (via drill 0.5)
  Top 0.305: C47.1 82.55,48.76 RP3.4 88.28,48.12 S2.2 89.15,45.47 90.31,44.31 | RP2.4 88.27,44.31 | 88.27,44.31 90.31,44.31 | 90.31,44.31 91.44,43.18 v91.44,40.64 | S2.1 89.15,43.42 88.27,44.31
  Bottom 0.305: v91.44,40.64 92.08,40.01 92.08,2.54 91.44,1.91 16.51,1.91 14.61,3.81 14.61,12.7 12.66,14.64 U$20.P$8
ISP_RESET  (via drill 0.46)
  Top 0.305: C51.2 36.52,4.76 38.1,3.17 v39.37,3.17
  Bottom 0.254: SJ3.2 v39.37,3.17 48.26,3.17 JP1.5 | SJ2.2 55.75,3.3
  Bottom 0.305: JP1.5 52.07,4.45 52.7,3.81 SJ2.2
MEGATXD  (via drill 0.46, 0.5)
  Top 0.254: U$21.2 31.44,48.84 v31.5,48.9 | v46.35,47.5 46.99,46.86 v46.99,42.8
  Top 0.305: U1.31 47.53,42.26 v46.99,42.8 | R11.1 25.91,40.01 26.54,40.64 v26.67,40.64
  Bottom 0.254: v31.5,48.9 31.5,48.51 33.02,46.99 45.85,46.99 v46.35,47.5 | v26.67,40.64 26.67,42.55 27.3,43.18 46.61,43.18 v46.99,42.8
MISO  (via drill 0.46)
  Top 0.254: 48.9,24.77 48.9,10.79 48.26,10.16 48.26,8.26 JP1.1 42.04,6.99 41.02,8 29.21,8 28.83,8.38 U4.16
  Top 0.305: 48.9,24.77 48.9,25.4 v50.16,26.67 | U1.16 52.33,26.93 v52.07,26.67
  Bottom 0.305: v50.16,26.67 v52.07,26.67
N$1
  Top 0.203: R1.2 15.55,64.45 19.68,60.33 23.3,60.33 C3.1 27.62,59.37 28.57,58.42 IC3.3
N$2
  Top 0.203: R1.1 11.74,66.36 10.16,64.77
  Top 0.305: 10.16,64.77 D3.C
N$3
  Top 0.406: IC1.2 11.91,26.82 13.97,24.77 14.29,24.77 C35.1 14.61,23.5 16.03,22.07 L2.1
N$4  (via drill 0.41)
  Top 0.305: LED10.A 1.49,13.55 v1.91,13.97
  Bottom 0.305: U$20.P$5 v1.91,13.97
N$5
  Top 0.305: C42.1 62.42,50.89 U6.4
N$9
  Top 0.305: R7.2 63.82,13.02 LED1.A
N$11
  Top 0.305: 51.47,30.63 U1.15 51.53,29.94 51,29.41 D4.C 51,24.33 49.53,22.86 49.53,14.9 R30.1
N$13  (via drill 0.5)
  Top 0.254: IC2.2 8.47,34.48 R13.2 10.16,33.66 9.4,32.89 v8.64,32.89
  Top 0.305: 9.88,34.33 R13.2 | U5.4 14.45,38.08 v14.61,37.85
  Bottom 0.305: v14.61,37.85 14.61,35.31 14.22,34.92 9.53,34.92 8.89,34.29 8.89,33.27 v8.64,32.89
N$14
  Top 0.305: C7.1 40.63,29.52 Y1.P$2 41.27,29.84 44.35,32.92 U1.7
N$15
  Top 0.305: U1.8 45.24,26.19 41.91,22.86 Y1.P$1 39.99,23.18 C8.1
N$16
  Top 0.305: IC3.1 31.11,59.82 Q1.1 33.66,62.36 C14.1
N$17
  Top 0.305: IC3.2 29.84,59.82 Q1.4 27.3,62.36 C15.1
N$19
  Top 0.254: RP1.4 44.59,17.86 LED3.C
N$20
  Top 0.254: RP1.3 45.39,20.21 LED4.C
N$21
  Top 0.305: LED10.C R10.1
N$22
  Top 0.305: U5.29 8.66,43.41 8,44.07 8,45.59 8.26,45.85 R15.2
N$23
  Top 0.305: U$19.P$2 3.17,59.05 1.49,60.74 LED11.A
N$24
  Top 0.305: R25.1 LED11.C
N$27  (via drill 0.5)
  Top 0.254: U$11.23 11.95,55.77 v11.43,55.24
  Bottom 0.254: LED6.C 10.16,53.98 v11.43,55.24
N$28  (via drill 0.5)
  Top 0.254: U$11.22 11.04,56.27 10.16,57.15 10.16,61.85 v10.54,62.23
  Bottom 0.254: LED7.C 10.16,61.85 v10.54,62.23
N$29  (via drill 0.46)
  Top 0.305: R6.2 25.65,17.65 U4.29 25.64,16.27 v26.04,15.88
  Bottom 0.305: v26.04,15.88 31.75,10.16 31.75,3.3 SJ3.1
N$30
  Top 0.254: C19.1 14.07,6.25 X1.P$1 21.43,10.54 U4.8
N$31
  Top 0.254: C27.1 14.06,10.26 X1.P$2 17.24,10.16 19.68,10.16 20.86,11.34 U4.7
N$32
  Top 0.305: U4.14 27.23,7.69 30.16,4.76 R8.1
N$33
  Top 0.305: U4.15 28.04,8.16 29.53,6.67 R14.1
N$34
  Top 0.305: U4.17 31.38,10.54 32.06,9.85 R16.1
N$35
  Top 0.254: C36.1 2.54,37.47 3.43,38.35 Q2.2
  Top 0.305: U5.30 7.06,42.62 6.35,41.91 6.35,38.73 5.71,38.1 4.7,38.1 Q2.2
N$36
  Top 0.254: C37.1 2.54,48.9 3.43,48.01 Q2.1
  Top 0.305: R15.1 4.51,47.94 Q2.1
N$39
  Top 0.406: JP2.1 JP1.2
N$40
  Top 0.305: LED2.A 30.48,25.4 29.84,26.04 R20.2
N$41
  Top 0.305: R21.2 27.3,25.4 28.57,24.13 LED5.A
N$42
  Bottom 0.254: LED6.A 6.45,51.66 R22.1
N$43
  Bottom 0.254: LED7.A 13.87,58.64 R23.1
N$44
  Top 0.254: U$11.9 19.75,56.27 R24.2
N$45
  Top 0.254: U$11.16 15.37,59.56 15.24,59.69 12.38,59.69 C10.1
N$46  (via drill 0.41)
  Top 0.254: U$11.17 14.87,57.9 v15.24,57.53
  Bottom 0.254: v15.24,57.53 15.24,68.58 14.93,68.89 R29.1
N$47
  Top 0.254: RP1.2 46.19,18.89 47.62,20.32 LED8.C
N$48
  Bottom 0.254: R29.2 10.26,67 ISUSPEND.A
N$51
  Top 0.254: 54.61,14.61 R31.1
  Top 0.305: U1.17 53.82,30.71 D5.C 54.18,30.28 55.24,29.21 55.24,27.3 53.98,26.04 53.98,15.24 54.61,14.61
N$52
  Top 0.305: LED9.A 41.05,39.15 41.91,40.01 R26.2
N$53
  Top 0.305: SJ5.2 42.35,43.05 R26.1
N$54
  Top 0.305: R8.2 R32.2 C51.1
N$58
  Top 0.305: R28.1 LED12.A
RESET_328  (via drill 0.46)
  Top 0.254: S1.2 S1.1 62.61,6.73 v60.96,5.08 | R9.2 60.14,16.96 v57.78,14.61
  Top 0.305: v52.07,24.13 53.34,22.86 v53.34,14.61 | U1.29 49.13,37.7 48.26,36.83 v48.26,34.29 | v60.96,5.08 60.78,4.9 D6.A 58.75,5.08 58.42,5.08 57.78,5.71 v57.78,14.61
  Bottom 0.254: SJ2.1 59.69,3.81 v60.96,5.08
  Bottom 0.305: v48.26,34.29 48.9,33.66 48.9,25.4 50.16,24.13 v52.07,24.13 | v53.34,14.61 v57.78,14.61
RT9193-OUT
  Top 0.406: 59.82,47.31 C20.1 | C20.1 57.28,47.18 FB1.1 | U6.5 64.11,47.66 63.5,48.26 61.59,48.26 60.52,47.18 C20.1
SDA  (via drill 0.46)
  Top 0.254: U$11.1 14.37,53.74 v13.97,53.34 | IC3.5 26.09,52.01 v25.4,52.7
  Top 0.305: U1.27 50.73,47.06 v46.99,50.8 46.65,51.14 U$7.1 | R4.1 40.33,48.58 40.89,49.15 v40.89,50.8 40.89,52.45 40.64,52.7 38.73,52.7 37.47,53.98 U$18.5
  Bottom 0.254: v40.89,50.8 v46.99,50.8 | v25.4,52.7 14.61,52.7 v13.97,53.34
  Bottom 0.305: v40.89,50.8 36.83,50.8 34.92,52.7 v25.4,52.7
UBLOX_RF_IN
  Top 0.61: 81.81,69 L1.1 81.98,68.96
  Top 1.016: U$2.11_RF_IN 81.81,69 | U$3.1 81.98,68.96
USB-3V3  (via drill 0.46, 0.5)
  Top 0.254: 80.64,54.61 80.64,62.23 80.17,62.7 77.57,62.7 arc-90 C52.1 arc-90 77.11,62.7 U$2.7_VDDUSB | 80.64,54.61 80.64,50.16 76.83,46.35 73.03,46.35 v72.39,46.99 | R24.1 21.97,57.21 21.97,57.78 | U5.22 13.66,42.85 v13.97,42.55 14.61,43.18 | U5.18 16.87,45.44 16.43,45.01 | 16.43,45.01 14.61,43.18 | U5.14 16.43,45.01 | U5.10 15.98,41.81 14.61,43.18 | v13.97,62.23 13.97,63.25 | R27.2 80.64,54.61 | U$11.5 16.37,53.48 16.7,53.15 17.27,53.15 | U$11.6 16.87,53.55 17.27,53.15 | U$11.7 18.39,55.27 19.05,54.61 | U$11.8 18.53,55.77 19.05,55.24 19.05,54.61 | 19.05,54.61 19.68,53.98 19.68,53.27 C32.1 17.27,53.15
  Top 0.305: C32.1 C31.1 | C38.1 17.46,35.88 | C38.1 C39.1 13.66,36.94 U5.3 | C31.1 21.97,57.78 21.97,58.67 20.95,59.69 19.43,59.69 15.88,63.25 13.97,63.25 9.91,63.25 9.53,62.87 9.53,56.52 6.99,53.98 6.99,52.7 8.19,51.5 C40.1 | v20.95,47.62 22.86,47.62 23.5,48.26 23.5,52.7 23.05,53.15 C31.1 | U5.26 U5.25 10.49,48.18 8.89,49.78 C40.1 | U5.8 18.34,39.45 19.05,38.73 19.05,36.58 WP8.1 | C40.1 7.94,50.48 v7.62,50.16 | IC2.3 7.37,37.65 C48.1 8.19,39.31 v8.89,40.01 | U5.10 20.42,41.81 20.95,41.27 20.95,37.21 WP8.1 | L2.2 17.14,30.48 19.68,33.02 WP8.1 | WP8.1 17.21,35.94 C38.1
  Bottom 0.254: v72.39,46.99 71.75,46.35 22.23,46.35 v20.95,47.62 | 9.53,45.72 9.53,48.26 v7.62,50.16 5.71,50.16 5.08,50.8 5.08,53.34 5.39,53.66 R22.2 | R23.2 v13.97,62.23
  Bottom 0.305: 9.53,45.72 11.43,43.81 12.7,43.81 v13.97,42.55 12.7,41.27 10.16,41.27 v8.89,40.01
USB_ASP_DMINUS_A  (via drill 0.46)
  Top 0.254: U5.11 20.88,42.62 22.23,41.27 D2.C
  Top 0.305: R18.2 21.27,2.86 20.95,3.17 v20.95,3.81 | R17.2 21.27,25.71 v20.95,26.04 20.95,33.02 22.23,34.29 D2.C
  Bottom 0.305: v20.95,3.81 v20.95,26.04
USB_ASP_DMINUS_B
  Top 0.305: U4.12 25.64,7.54 R18.1
USB_ASP_DPLUS_A  (via drill 0.46)
  Top 0.254: U5.12 21.36,43.41 24.77,40.01 D1.C
  Top 0.305: R19.2 25.71,2.86 v24.77,3.81 | v24.77,25.4 24.77,28.57 26.04,29.84 26.04,33.02 24.77,34.29 D1.C
  Bottom 0.305: v24.77,3.81 v24.77,25.4
USB_ASP_DPLUS_B
  Top 0.305: R19.1 26.43,5.63 U4.13 26.43,12.94 23.23,16.14 U4.32
USB_CP_DMINUS_A
  Top 0.254: U$11.4 15.87,48.37 U5.19
USB_CP_DPLUS_A
  Top 0.254: U$11.3 15.37,48.29 U5.20
USB_FT_DMINUS_A
  Top 0.305: U$21.7 27.65,45.4 RN2.3
USB_FT_DMINUS_B
  Top 0.305: U5.15 23.58,45.82 C33.1 25.19,45.32 RN2.2
USB_FT_DPLUS_A
  Top 0.305: U$21.6 27.65,46.05 RN2.4
USB_FT_DPLUS_B
  Top 0.305: U5.16 24.57,46.61 C34.1 25.57,46.12 RN2.1
USB_HUB_DMINUS_A
  Top 0.254: U5.2 RN1.3
USB_HUB_DMINUS_B  (via drill 0.5)
  Top 0.305: CN1.D- 84.92,53.81 v84.45,53.34 | RN1.2 12.85,32.24 14.61,30.48 v15.88,30.48
  Bottom 0.305: v84.45,53.34 82.55,53.34 81.92,52.7 81.92,45.72 80.01,43.81 17.14,43.81 16.51,43.18 16.51,31.11 v15.88,30.48
USB_HUB_DPLUS_A
  Top 0.254: U5.1 12.06,35.85 RN1.4
USB_HUB_DPLUS_B  (via drill 0.5)
  Top 0.305: CN1.D+ v83.19,54.61 R27.1 | RN1.1 12.05,31.13 v12.7,30.48
  Bottom 0.305: v83.19,54.61 82.55,54.61 81.28,53.34 81.28,46.35 79.38,44.45 16.51,44.45 15.88,43.81 15.88,32.38 13.97,30.48 v12.7,30.48
USB_NEO_DMINUS_A
  Top 0.254: U$2.5_USB_DM 77.1,60.5 R5.2
USB_NEO_DMINUS_B  (via drill 0.46)
  Top 0.254: R5.1 77.34,56.64 v77.47,56.52 | U5.23 12.85,50.77 v12.06,51.56
  Bottom 0.254: v77.47,56.52 80.01,53.98 80.01,47.12 78.61,45.72 12.7,45.72 12.06,46.35 v12.06,51.56
USB_NEO_DPLUS_A
  Top 0.254: U$2.6_USB_DP 79.19,61.6 R2.2
USB_NEO_DPLUS_B  (via drill 0.46)
  Top 0.254: R2.1 v79.38,57.15 | U5.24 12.06,48.9 11.68,49.28 v11.18,49.28
  Bottom 0.254: v79.38,57.15 79.38,55.88 80.64,54.61 80.64,46.99 78.74,45.09 11.81,45.09 11.18,45.72 v11.18,49.28
USB_RAW_5V  (via drill 0.5)
  Top 0.305: F3.2 10.16,6.99 v10.79,6.35 | v85.09,51.44 85.09,52.07 86.03,53.01 CN1.VBUS
  Bottom 0.305: v85.09,51.44 85.09,48.26 85.72,47.62 92.08,47.62 92.71,46.99 92.71,1.91 92.08,1.27 15.88,1.27 v10.79,6.35
VBAT  (via drill 0.46)
  Top 0.203: U$2.22_V_BCKP 58.94,58.3 v58.42,57.78 | BAT1.PWR@1 33.4,68.2 v34.29,67.31
  Bottom 0.203: v58.42,57.78 58.42,67.94 57.15,69.22 36.2,69.22 v34.29,67.31
VBAT_RTC
  Top 0.203: BAT2.PWR@1 10.79,69.85 10.16,69.22 D3.A
VCC_RF
  Top 0.254: U$2.8_RESERVED 74.47,65.7 75.56,66.8
  Top 0.305: U$2.9_VCC_RF 75.56,66.8 79.18,66.8 R12.1
VCC_RF_2
  Top 0.305: R12.2 79.38,64.7 C23.1 L1.2
VUSB
  Top 0.305: C30.1 21.91,20 WP7.1 | U4.18 32.6,11.34 C29.1 33.34,11.75 34.92,13.34 34.92,18.41 31.75,21.59 31.75,27.94 30.8,28.89 R20.1 R21.1 | C28.1 18.73,13.65 17.14,15.24 17.14,17.14 18.41,18.41 19.68,18.41 20.32,19.05 C30.1 | U4.4 19.13,13.73 C28.1 | WP7.1 R17.1 | WP7.1 25.21,23.3 R6.1 25.65,28.19 26.35,28.89 R21.1 | U4.6 19.61,12.13 19.05,12.7 C28.1 | 30.67,39.24 C43.1 | R21.1 27.3,29.84 29.21,31.75 29.21,38.73 29.52,39.05 C43.1 | C30.1 20,20 | F3.1 11.81,11.18 15.88,15.24 15.88,18.41 17.14,19.68 20,19.68 C30.1 | U$21.10 30.79,39.36 C43.1
  Top 0.406: IC1.3 7.52,29.11 6.99,28.57 6.99,22.86 7.62,22.23 13.97,22.23 15.88,20.32 20,20.32 C30.1
WIREPAD_D7  (via drill 0.46)
  Top 0.305: RP2.1 83.19,40.01 WP1.1 | RP3.2 84.92,46.52 85.72,45.72 v85.72,45.09
  Bottom 0.305: v85.72,45.09 82.55,41.91 WP1.1
WIREPAD_D8  (via drill 0.46)
  Top 0.305: RP2.2 84.29,42.71 85.72,41.27 WP2.1 | RP3.1 v84.33,45.72
  Bottom 0.305: v84.33,45.72 84.96,46.35 86.36,46.35 87,45.72 87,40.64 WP2.1

## Text on the board
Top: C | Los Angeles
tPlace: CR1220 | Program as Arduino Nano via USBASP / APA102 Controller on MOSI and SCK | eeprom | 27 / nH | E | 10R | SMA | A1 | 1k | 100n | 100n | 1k | 32k | PMEG6002EJ | for RTC | for GPS | 8.2pF | 100n | 8.2pF | 32 / kHz | NEOTX | NEORX | NEO-7M | 4.7u | 100n | NEO / 6M/Q / 7M/Q | >38.4kbps / requires / 14.7456 / Crystal | NEOSDA | NEOSCL | 100p | SDA | SCL | MCP | 5V | 27 | 27 | SIL | 4.7k | MCP79412 | 100n | MCP9808 | USB | CP2112 | 794 | 1u | 100n | 100n | 22n | 100k | 10u | 22p | 100n | 1u | 1.5k / D+ | 100n | Fe | 1u | 100n | 100n | 4.7k | 4.7k | 3V3 | 27R | 4.7T | RT9193 | TUSB | 47pF | Tudor | 1k | FT230XQ | m328p | 1u | 6MHz | TUSB2046B | 1k | GND | D4 | EN | 5V | 10k | 1.5k | 47pF | 74ACT14 | D8 | D7 | 100n | 1k | RT-ENABLE | 1 | 74ACT14 | INT1 | D10 | PPS | 10u | 3.6V / Zener | 100n | 10u | 10k | 100n | 20170301 | 6(5)A | ATMEGA | 100n | at / 25(50)dC | 5V | 22p | 3V3 | 100n | 100n | MAX / 809 | 27R | 1u | 100n | 100k | 100n | 5V | CB1 | 16MHz | 5.1Z | 10 | +5V | 5.1Z | 2k2 | 1k | 22p | 4.7 | AMS1117 | Fe | 16 | D9 | 1u | R | Y | D6 | SCK | 22u | 10k | 22p | D5 | VUSB | MOSI | WRITE | R | 10k | 4.7T | W | PWR | G | 1000 | 1000 | GND | 1 | m88pa | 10 | 220PTC | 1k | 220PTC | 100n | 1k | at / 25(50)dC | USB / ASP | 100n | 1k | 270 | PWR | Fuse | A2 | 22p | 12 | 12MHz | IDC POWER / JUMPER | 8(6)A | 1N4733 5.1Z | 22p | red | black | 270 | 68 | 68 | 1N4148 | 270 | 10k | 100n | PROGRAM | DISCONNECT LED POWER BEFORE PROGRAMMING | RESET | DC+5V ONLY
bPlace: Copyright 2017 / ptudor.net | gitlab.com/apa102-controller | 2.75"x3.5 | 1k | !SUS | 1k | RK09712200HA | Rx | Tx | 1k | 5V | INT0: PPS / INT1: ALPS | D5: LED / D6: LED / D9: LED | A1,2: Trimpot / D0: GPS Tx / D1: 328P Tx | D11: MOSI (DO) / D13: SCK (CO) / / D4: RT9193 EN / (GPS Power) | Co | 1"x.75 | Do | GND | RK0971224Z01 | CALIFORNIA REPUBLIC | DC 5V C+ | 76mm x 95mm / 2990 x 3725mil | .25"x3.5" | ASP-PROG | MCU-PROG
tNames: TLC5916 7SEG 01 | OUT | LE | OE | CL | IN | G | 5V | http://ptudor.net